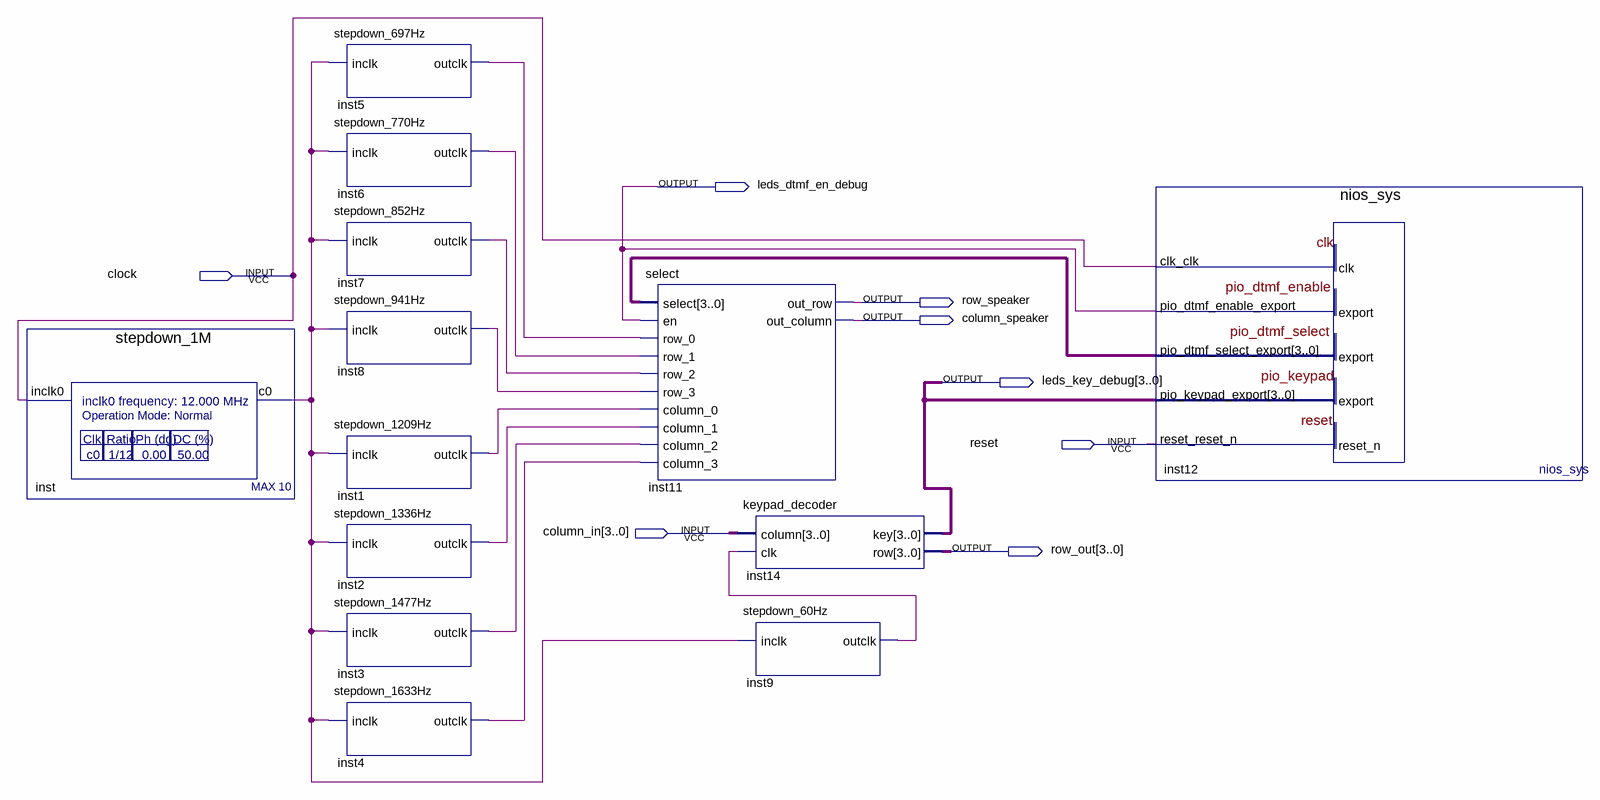
[diagram p0: schematic sheet]
// Quartus schematic dtmf.bdf as structural Verilog: 13 symbols, 8 pins
module dtmf (
  input  clock,
  input  reset,
  input  [3:0] column_in,
  output leds_dtmf_en_debug,
  output row_speaker,
  output column_speaker,
  output [3:0] leds_key_debug,
  output [3:0] row_out
);

  wire inst1_outclk, inst2_outclk, inst3_outclk, inst4_outclk, inst5_outclk, inst6_outclk, inst7_outclk,
       inst8_outclk, inst9_outclk, inst_c0;
  wire [3:0] inst12_pio_dtmf_select_export;

  stepdown_1M inst (.inclk0(clock), .c0(inst_c0));
  stepdown_697Hz inst5 (.inclk(inst_c0), .outclk(inst5_outclk));
  stepdown_770Hz inst6 (.inclk(inst_c0), .outclk(inst6_outclk));
  stepdown_852Hz inst7 (.inclk(inst_c0), .outclk(inst7_outclk));
  stepdown_941Hz inst8 (.inclk(inst_c0), .outclk(inst8_outclk));
  stepdown_1209Hz inst1 (.inclk(inst_c0), .outclk(inst1_outclk));
  stepdown_1336Hz inst2 (.inclk(inst_c0), .outclk(inst2_outclk));
  stepdown_1477Hz inst3 (.inclk(inst_c0), .outclk(inst3_outclk));
  stepdown_1633Hz inst4 (.inclk(inst_c0), .outclk(inst4_outclk));
  select inst11 (
    .select(inst12_pio_dtmf_select_export), .en(leds_dtmf_en_debug), .row_0(inst5_outclk),
    .row_1(inst6_outclk), .row_2(inst7_outclk), .row_3(inst8_outclk), .column_0(inst1_outclk),
    .column_1(inst2_outclk), .column_2(inst3_outclk), .column_3(inst4_outclk), .out_row(row_speaker),
    .out_column(column_speaker));
  keypad_decoder inst14 (.column(column_in), .clk(inst9_outclk), .key(leds_key_debug), .row(row_out));
  stepdown_60Hz inst9 (.inclk(inst_c0), .outclk(inst9_outclk));
  nios_sys inst12 (
    .clk_clk(clock), .pio_keypad_export(leds_key_debug), .reset_reset_n(reset),
    .pio_dtmf_enable_export(leds_dtmf_en_debug), .pio_dtmf_select_export(inst12_pio_dtmf_select_export));
endmodule
